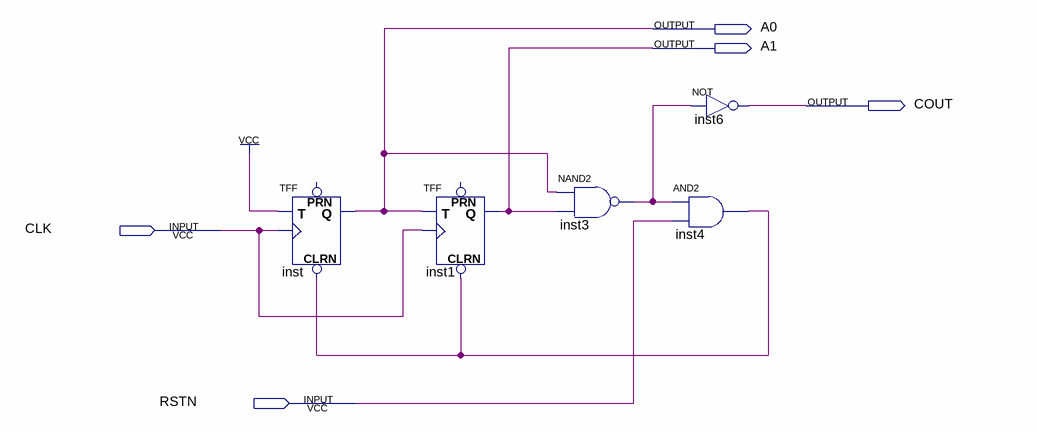
[diagram p0: schematic sheet]
// Quartus schematic cnt_mod3.bdf as structural Verilog: 5 symbols, 5 pins
module cnt_mod3 (
  input  CLK,
  input  RSTN,
  output A0,
  output A1,
  output COUT
);

  wire inst3_out, inst4_out;

  TFF inst (.CLRN(inst4_out), .T(1'b1), .CLK(CLK), .Q(A0));  // open: PRN
  TFF inst1 (.CLRN(inst4_out), .T(A0), .CLK(CLK), .Q(A1));  // open: PRN
  nand inst3 (inst3_out, A0, A1);
  not inst6 (COUT, inst3_out);
  and inst4 (inst4_out, inst3_out, RSTN);
endmodule
